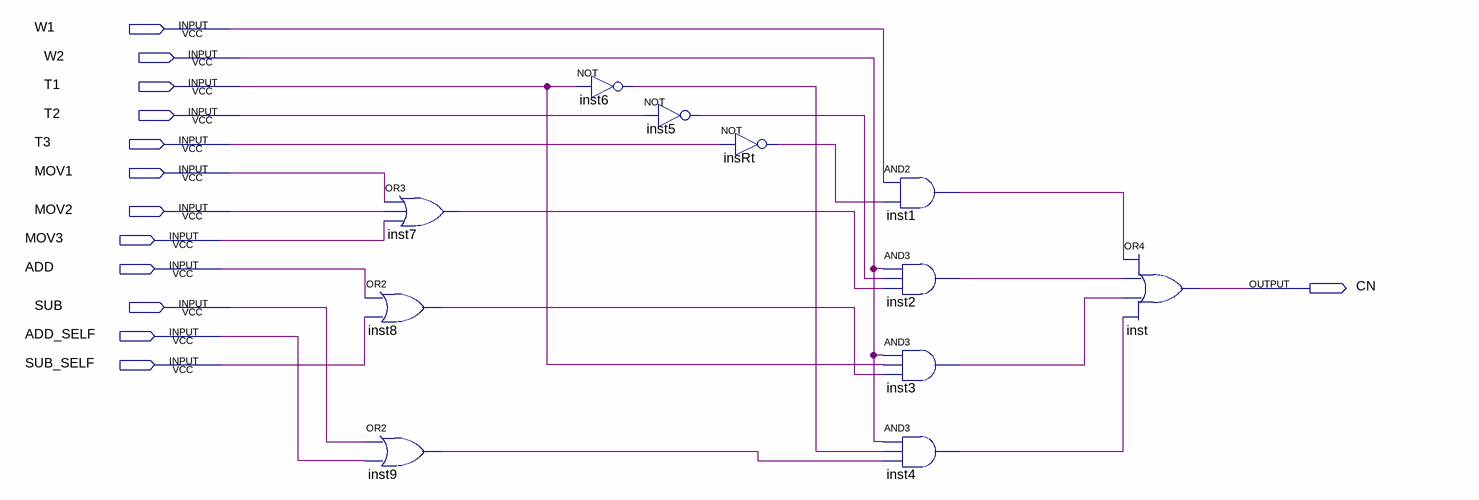
[diagram p0: schematic sheet]
// Quartus schematic CN.bdf as structural Verilog: 11 symbols, 13 pins
module CN (
  input  W1,
  input  W2,
  input  T1,
  input  T2,
  input  T3,
  input  MOV1,
  input  MOV2,
  input  MOV3,
  input  ADD,
  input  SUB,
  input  ADD_SELF,
  input  SUB_SELF,
  output CN
);

  wire insRt_out, inst1_out, inst2_out, inst3_out, inst4_out, inst5_out, inst6_out, inst7_out, inst8_out,
       inst9_out;

  or inst8 (inst8_out, ADD, SUB_SELF);
  or inst9 (inst9_out, SUB, ADD_SELF);
  or inst7 (inst7_out, MOV1, MOV2, MOV3);
  not inst6 (inst6_out, T1);
  not inst5 (inst5_out, T2);
  not insRt (insRt_out, T3);
  and inst1 (inst1_out, W1, insRt_out);
  and inst2 (inst2_out, W2, inst5_out, inst7_out);
  and inst3 (inst3_out, W2, T1, inst8_out);
  and inst4 (inst4_out, W2, inst6_out, inst9_out);
  or inst (CN, inst1_out, inst2_out, inst3_out, inst4_out);
endmodule
